# Altium schematic sheet Cyber_VCM.SchDoc
size A3
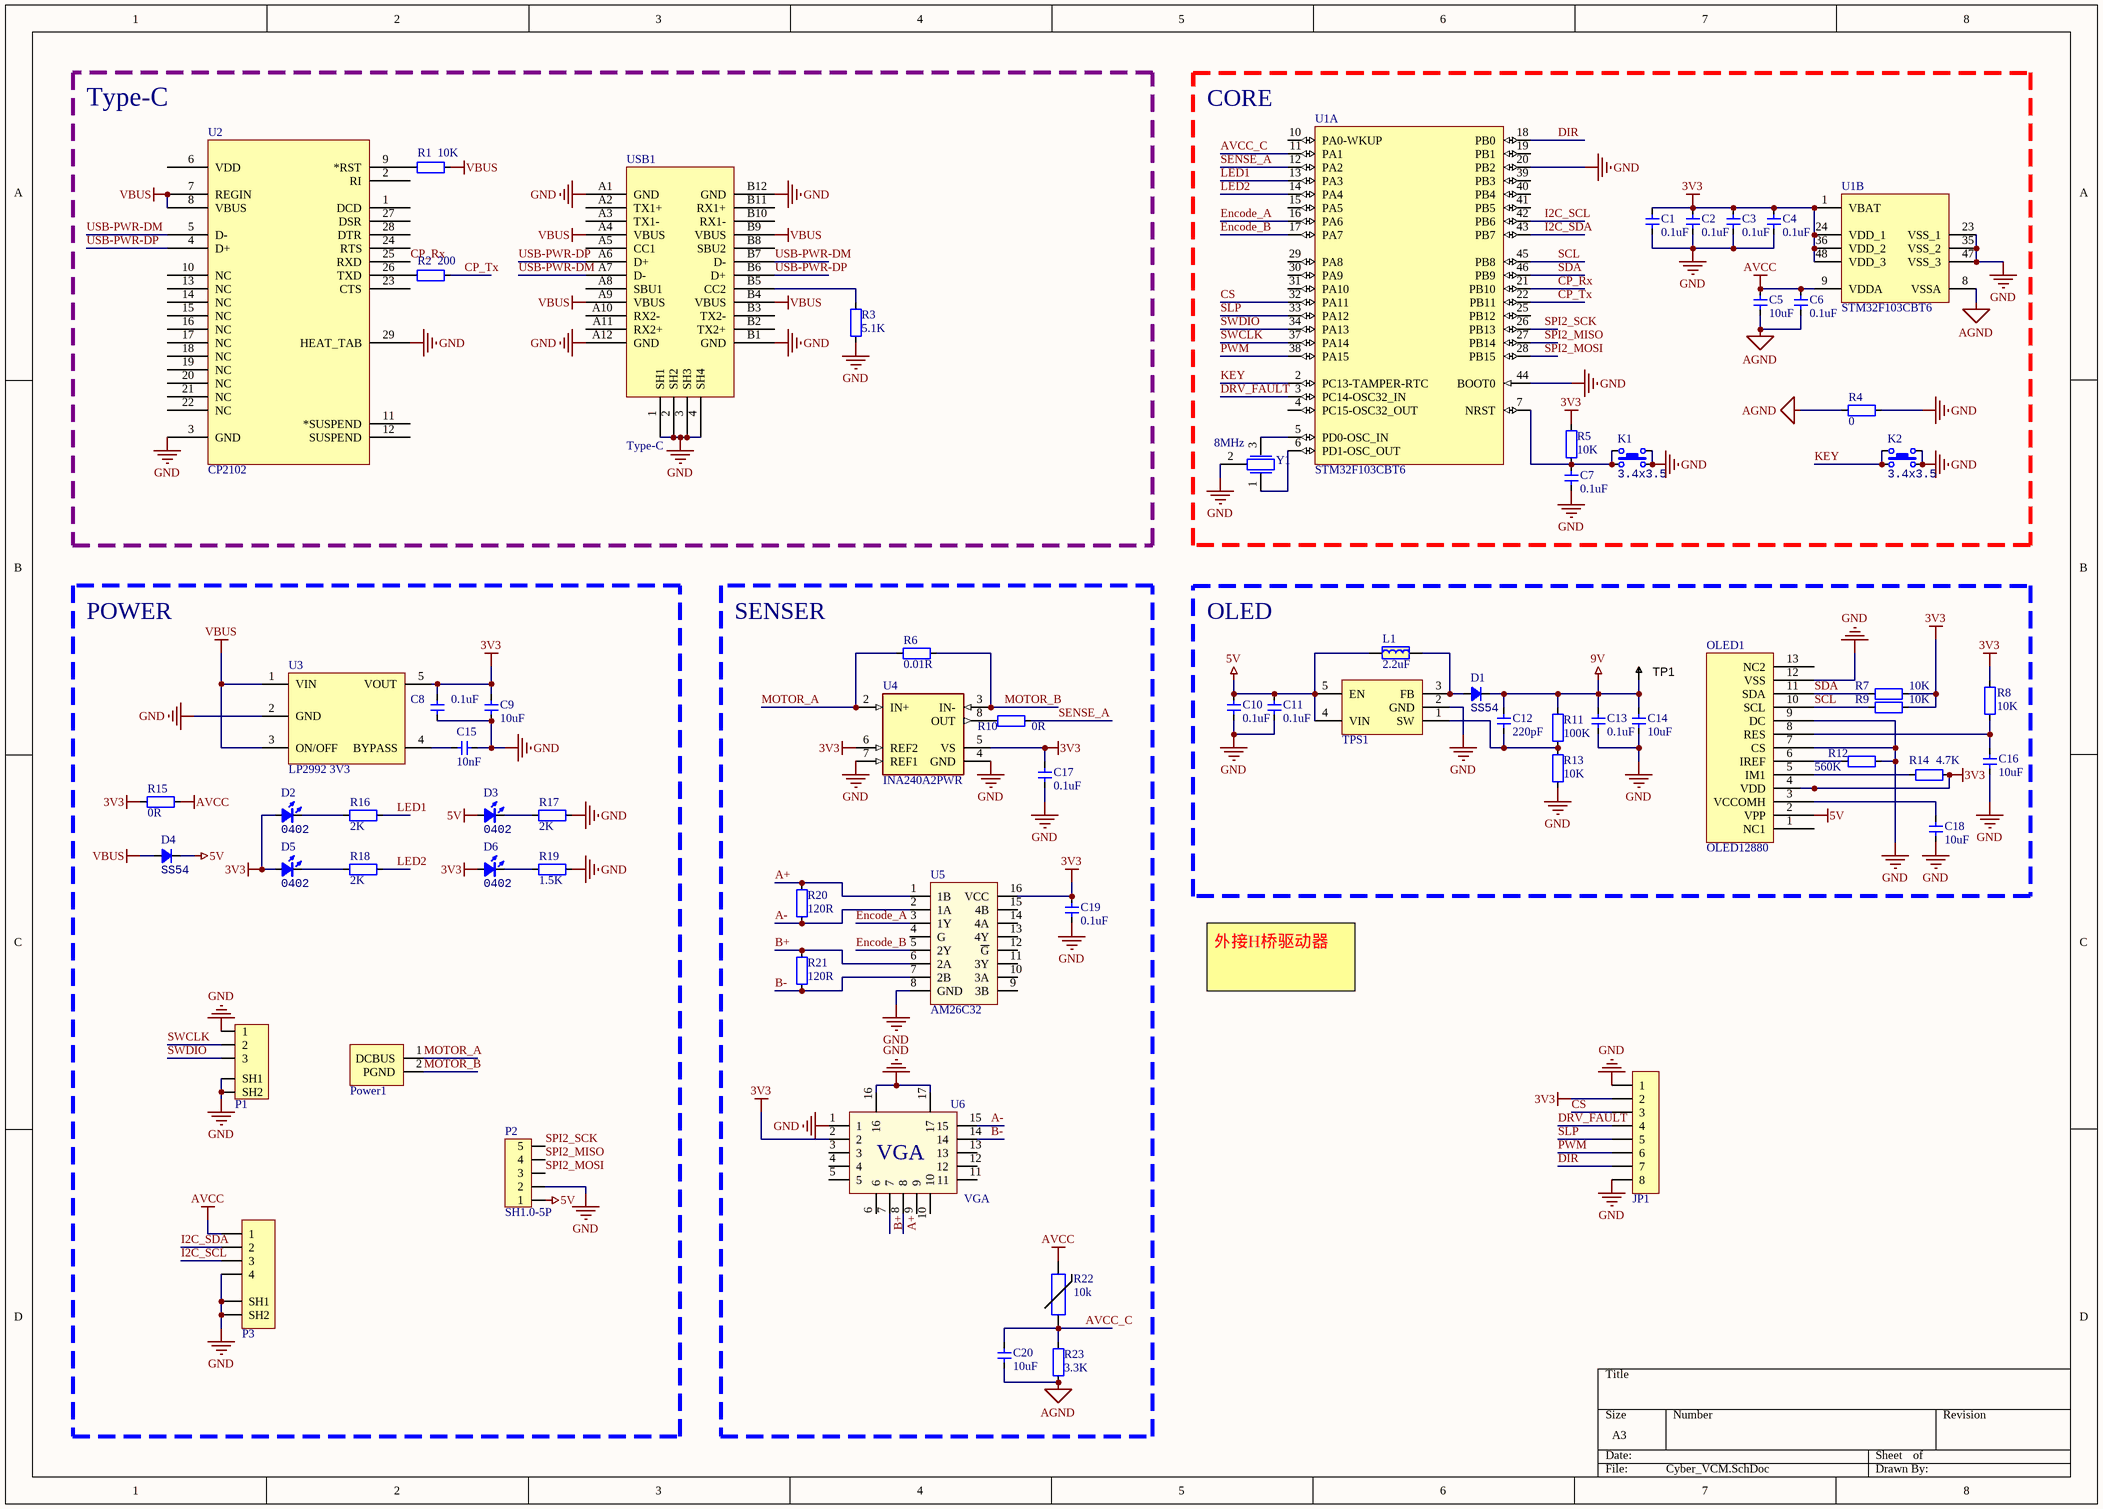
[diagram p0: Cyber_VCM.SchDoc]

## Parts
C1  0.1uF  [CAP_0402]
C2  0.1uF  [CAP_0402]
C3  0.1uF  [CAP_0402]
C4  0.1uF  [CAP_0402]
C5  10uF  [CAP_0402]
C6  0.1uF  [CAP_0402]
C7  0.1uF  [CAP_0402]
C8  0.1uF  [CAP_0402]
C9  10uF  [CAP_0402]
C10  0.1uF  [CAP_0402]
C11  0.1uF  [CAP_0402]
C12  220pF  [CAP_0402]
C13  0.1uF  [0603-CAP]
C14  10uF  [0603-CAP]
C15  10nF  [CAP_0402]
C16  10uF  [CAP_0402]
C17  0.1uF  [CAP_0402]
C18  10uF  [CAP_0402]
C19  0.1uF  [0603-CAP]
C20  10uF  [CAP_0402]
D1  SS54  [DO-214AC]
D2  Type: 0402  [LED_0402_BLUE]  (hidden comment: color?)
D3  Type: 0402  [LED_0402_BLUE]  (hidden comment: color?)
D4  SS54  [DO-214AC]
D5  Type: 0402  [LED_0402_BLUE]  (hidden comment: color?)
D6  Type: 0402  [LED_0402_BLUE]  (hidden comment: color?)
JP1  HDR-1X8  [HDR2.54-M-LI-8P]  (value not drawn)
K1  value 3.4x3.5  [ButtonTACT_3.5*3.55_90]  (hidden comment: TACT 4P)
K2  value 3.4x3.5  [ButtonTACT_3.5*3.55_90]  (hidden comment: TACT 4P)
L1  2.2uF  [2520-L]
OLED1  OLED12880  [OLED12880]
P1  SH1.0-3P  [SH1.0-3P]  (value not drawn)
P2  SH1.0-5P  [SH1.0-5P]
P3  SH1.0-4P  [SH1.0-4P]  (value not drawn)
Power1  电源  [TX60电源]  (value not drawn)
R1  10K  [RES_0402]
R2  200  [RES_0402]
R3  5.1K  [RES_0402]
R4  0  [RES_0402]
R5  10K  [RES_0402]
R6  0.01R  [1206-RES]
R7  10K  [RES_0402]
R8  10K  [RES_0402]
R9  10K  [RES_0402]
R10  0R  [RES_0402]
R11  100K  [RES_0402]
R12  560K  [RES_0402]
R13  10K  [RES_0402]
R14  4.7K  [RES_0402]
R15  0R  [RES_0402]
R16  2K  [RES_0402]
R17  2K  [RES_0402]
R18  2K  [RES_0402]
R19  1.5K  [RES_0402]
R20  120R  [RES_0603]
R21  120R  [RES_0603]
R22  value 10k  [RES_0402]  (hidden comment: NCP15XH103F03RC)
R23  3.3K  [RES_0402]
TP1  TESTPOINT  [TP-R30]  (value not drawn)  (no BOM)
TPS1  TPS61040DBV  [SOT23-5]  (value not drawn)
U1  STM32F103CBT6  [LQFP-48]  (parts A,B of 2)
U2  CP2102  [QFN-28]
U3  LP2992 3V3  [SOT23-5]
U4  INA240A2PWR  [SOP65 P640X120-8N]
U5  AM26C32  [SOP16]
U6  VGA  [VGA15A]
USB1  Type-C  [Type-C-TOP]
Y1  8MHz  [晶振-3P]

## Blocks framed on the sheet
Type-C: R1-R3 U2 USB1
POWER: C8 C9 C15 D2-D6 P1-P3 Power1 R15-R19 U3
SENSER: C17 C19 C20 R6 R10 R20-R23 U4-U6
OLED: C10-C14 C16 C18 D1 L1 OLED1 R7-R9 R11-R14 TP1 TPS1

## Nets
3V3: C1.2 C2.2 C3.2 C4.2 C8.2 C9.2 C17.2 C19.2 D2.1(A) D5.1(A) D6.1(A) JP1.2 OLED1.4(VDD) R5.2 R7.2 R8.2 R9.2 R14.2 R15.2 U1.1(VBAT) U1.24(VDD_1) U1.36(VDD_2) U1.48(VDD_3) U3.5(VOUT) U4.5(VS) U4.6(REF2) U5.16(VCC) U6.2
5V: C10.2 C11.2 D3.1(A) D4.2(K) L1.1 OLED1.2(VPP) P2.1 TPS1.4(VIN) TPS1.5(EN)
9V: C12.2 C13.2 C14.2 D1.2(K) R11.2 TP1.1
AGND: C5.1 C6.1 C20.1 R4.1 R23.1 U1.8(VSSA)
AVCC: C5.2 C6.2 P3.1 R15.1 R22.2 U1.9(VDDA)
GND: C1.1 C2.1 C3.1 C4.1 C7.1 C8.1 C9.1 C10.1 C11.1 C13.1 C14.1 C15.2 C16.1 C17.1 C18.1 C19.1 JP1.1 JP1.8 K1.2 K1.4 K2.2 K2.4 OLED1.7(CS) OLED1.9(DC) OLED1.12(VSS) P1.1 P1.SH1 P1.SH2 P2.2 P3.4 P3.SH1 P3.SH2 R3.2 R4.2 R12.2 R13.1 R17.2 R19.2 TPS1.2(GND) U1.20(PB2) U1.23(VSS_1) U1.35(VSS_2) U1.44(BOOT0) U1.47(VSS_3) U2.3(GND) U2.29(HEAT_TAB) U3.2(GND) U4.4(GND) U4.7(REF1) U5.8(GND) U6.1 U6.16 U6.17 USB1.1(SH1) USB1.2(SH2) USB1.3(SH3) USB1.4(SH4) USB1.A1(GND) USB1.A12(GND) USB1.B1(GND) USB1.B12(GND) Y1.2
VBUS: D4.1(A) R1.1 U2.7(REGIN) U2.8(VBUS) U3.1(VIN) U3.3(ON/OFF) USB1.A4(VBUS) USB1.A9(VBUS) USB1.B4(VBUS) USB1.B9(VBUS)
A+: R20.2 U5.1(1B) U6.8
A-: R20.1 U5.2(1A) U6.15
AVCC_C: C20.2 R22.1 R23.2 U1.11(PA1)
B+: R21.2 U5.6(2A) U6.7
B-: R21.1 U5.7(2B) U6.14
CP_Rx: U1.21(PB10) U2.25(RXD)
CP_Tx: R2.1 U1.22(PB11)
CS: JP1.3 U1.32(PA11)
DIR: JP1.7 U1.18(PB0)
DRV_FAULT: JP1.4 U1.3(PC14-OSC32_IN)
Encode_A: U1.16(PA6) U5.3(1Y)
Encode_B: U1.17(PA7) U5.5(2Y)
I2C_SCL: P3.3 U1.42(PB6)
I2C_SDA: P3.2 U1.43(PB7)
KEY: K2.1 K2.3 U1.2(PC13-TAMPER-RTC)
LED1: R16.2 U1.13(PA3)
LED2: R18.2 U1.14(PA4)
MOTOR_A: Power1.1(DCBUS) R6.1 U4.2(IN+)
MOTOR_B: Power1.2(PGND) R6.2 U4.3(IN-)
PWM: JP1.6 U1.38(PA15)
SCL: OLED1.10(SCL) R9.1 U1.45(PB8)
SDA: OLED1.11(SDA) R7.1 U1.46(PB9)
SENSE_A: R10.2 U1.12(PA2)
SLP: JP1.5 U1.33(PA12)
SPI2_MISO: P2.4 U1.27(PB14)
SPI2_MOSI: P2.3 U1.28(PB15)
SPI2_SCK: P2.5 U1.26(PB13)
SWCLK: P1.2 U1.37(PA14)
SWDIO: P1.3 U1.34(PA13)
USB-PWR-DM: U2.5(D-) USB1.A7(D-) USB1.B7(D-)
USB-PWR-DP: U2.4(D+) USB1.A6(D+) USB1.B6(D+)
NetC7_2: C7.2 K1.1 K1.3 R5.1 U1.7(NRST)
NetC12_1: C12.1 R11.1 R13.2 TPS1.1(SW)
NetC15_1: C15.1 U3.4(BYPASS)
NetC16_2: C16.2 OLED1.8(RES) R8.1
NetC18_2: C18.2 OLED1.3(VCCOMH)
NetD1_1: D1.1(A) L1.2 TPS1.3(FB)
NetD2_2: D2.2(K) R16.1
NetD3_2: D3.2(K) R17.1
NetD5_2: D5.2(K) R18.1
NetD6_2: D6.2(K) R19.1
NetOLED1_5: OLED1.5(IM1) R14.1
NetOLED1_6: OLED1.6(IREF) R12.1
NetR1_2: R1.2 U2.9(*RST)
NetR2_2: R2.2 U2.26(TXD)
NetR3_1: R3.1 USB1.B5(CC2)
NetR10_1: R10.1 U4.8(OUT)
NetU1_5: U1.5(PD0-OSC_IN) Y1.3
NetU1_6: U1.6(PD1-OSC_OUT) Y1.1

Not connected (* = marked no-connect by the designer): OLED1 1(NC1) 13(NC2); U1 4(PC15-OSC32_OUT) 10(PA0-WKUP) 15(PA5) 19(PB1) 25(PB12) 29(PA8) 30(PA9) 31(PA10) 39(PB3) 40(PB4) 41(PB5); U2 1(DCD) 2(RI) 6(VDD) 10(NC) 11(*SUSPEND) 12(SUSPEND) 13(NC) 14(NC) 15(NC) 16(NC) 17(NC) 18(NC) 19(NC) 20(NC) 21(NC) 22(NC) 23(CTS) 24(RTS) 27(DSR) 28(DTR); U5 4(G) 9(3B) 10(3A) 11(3Y) 12(~{G}) 13(4Y) 14(4A) 15(4B); U6 3 4 5 6 9 10 11 12 13; USB1 A2(TX1+) A3(TX1-) A5(CC1) A8(SBU1) A10(RX2-) A11(RX2+) B2(TX2+) B3(TX2-) B8(SBU2) B10(RX1-) B11(RX1+)

## Notes on the sheet
- CORE
- 外接H桥驱动器

## Library data of the parts
C1-C12 C15-C18 C20 = 电容-0402: Capacitor; Value: 0.1u
C13 C14 C19 = 电容-0603: Capacitor; Value: 0.1u
D1 D4 = Diode_SMA: Diode; Type: SMA; Value: SS54
D2 D3 D5 D6 = LED_0402: LED; Value: color?
JP1 = Header 8: 8P接插件; 版权归属: 源创客; BOM名称: 8P接插件; 学习资源: www.ooocke.com
K1 K2 = ButtonTACT: Button; type: TACT 4P
L1 = 电感-0805: 磁珠
OLED1 = OLED12880: 12880寸OLED
P1 = SH1.0-3P: Header
P3 = SH1.0-4P: BOM名称: 4P接插件; 厂商: JST
Power1 = 电源: 12~24VDC电源
R1-R5 R7-R19 R23 = 电阻-0402: Resistor; Value: 22R
R6 = 电阻-1206: Resistor; Value: 22R
R20 R21 = 电阻-0603: Resistor; Value: 22R
R22 = NCP15XH103F03RC: THERMISTOR 10K OHM NTC 0402 SMD
TP1 = TESTPOINT: SMD test pin
U1 = STM32F103CBT6: ARM Cortex-M3 32-bit MCU, 128 KB Flash, 20 KB Internal RAM, 37 I/Os, 48-pin LQFP, -40 to 85 degC, Tray; A/D Converter: 2x12-bit (10 Channel); FLASH Size (Prog) (kB): 128; I/Os (High Current): 37; Internal RAM Size (kB): 20; Operating Frequency(F) (Processor speed) (MHz): 72; Supply Voltage(Vcc) min (V): 2; DatasheetVersion: Rev. 16; PackageVersion: Rev. 6, 06/2013; PackageReference: LQFP48; PackageDescription: 48-Pin Low Profile Quad Flat Package, 7 x 7 mm Body, 0.5 mm Pitch; Supplier 1: Digi-Key; Supplier Part Number 1: 497-6288-ND; Supplier 2: Farnell; Supplier Part Number 2: 1606327; Supplier 3: Newark; Supplier Part Number 3: 11N8296; Supplier 4: Newark; Supplier Part Number 4: 57P1214; Supplier 5: Mouser; Supplier Part Number 5: 511-STM32F103CBT6; Core: ARM Cortex-M3; Packing: Tray; Mounting Technology: Surface Mount; PartNumber: STM32F103CBT6; ComponentLink1Description: Manufacturer URL; ComponentLink1URL: http://www.st.com/web/en/home.html; ComponentLink2Description: Datasheet; ComponentLink2URL: http://www.st.com/st-web-ui/static/active/en/resource/technical/document/datasheet/CD00161566.pdf; ComponentLink3Description: Package Specification; ComponentLink3URL: http://www.st.com/st-web-ui/static/active/en/resource/technical/document/datasheet/DM00058181.pdf
U2 = CP2102: USB转TTL; PART DESC: SINGLE-CHIP USB TO UART BRIDGE, QFN28, RoHS.; MFG #1: SILICON LABS; PART NUMBER: CP2102; Value: Value; RefDes: RefDes; Type: DEV
U3 = LP2992: LDO
U4 = INA240A2PWR: -4 to 80V, bidirectional, ultra-precise current sense amplifier with enhanced PWM rejection 8-TSSOP -40 to 125; MF: Texas Instruments; MP: INA240A2PWR; Value: *; Package: TSSOP-8 Texas Instruments; Price: None; Availability: Good; Purchase-URL: https://pricing.snapeda.com/search/part/INA240A2PWR/?ref=eda; SnapEDA_Link: https://www.snapeda.com/parts/INA240A2PWR/Texas%20Instruments/view-part/588604/?ref=snap
U5 = AM26C32: AM26C32 Quadruple Differential Line Receiver
USB1 = USB-Type-C-TOP
Y1 = 晶振-3Pin: 村田贴片